# EAGLE design accel_sensor (EAGLE 9.3.0)
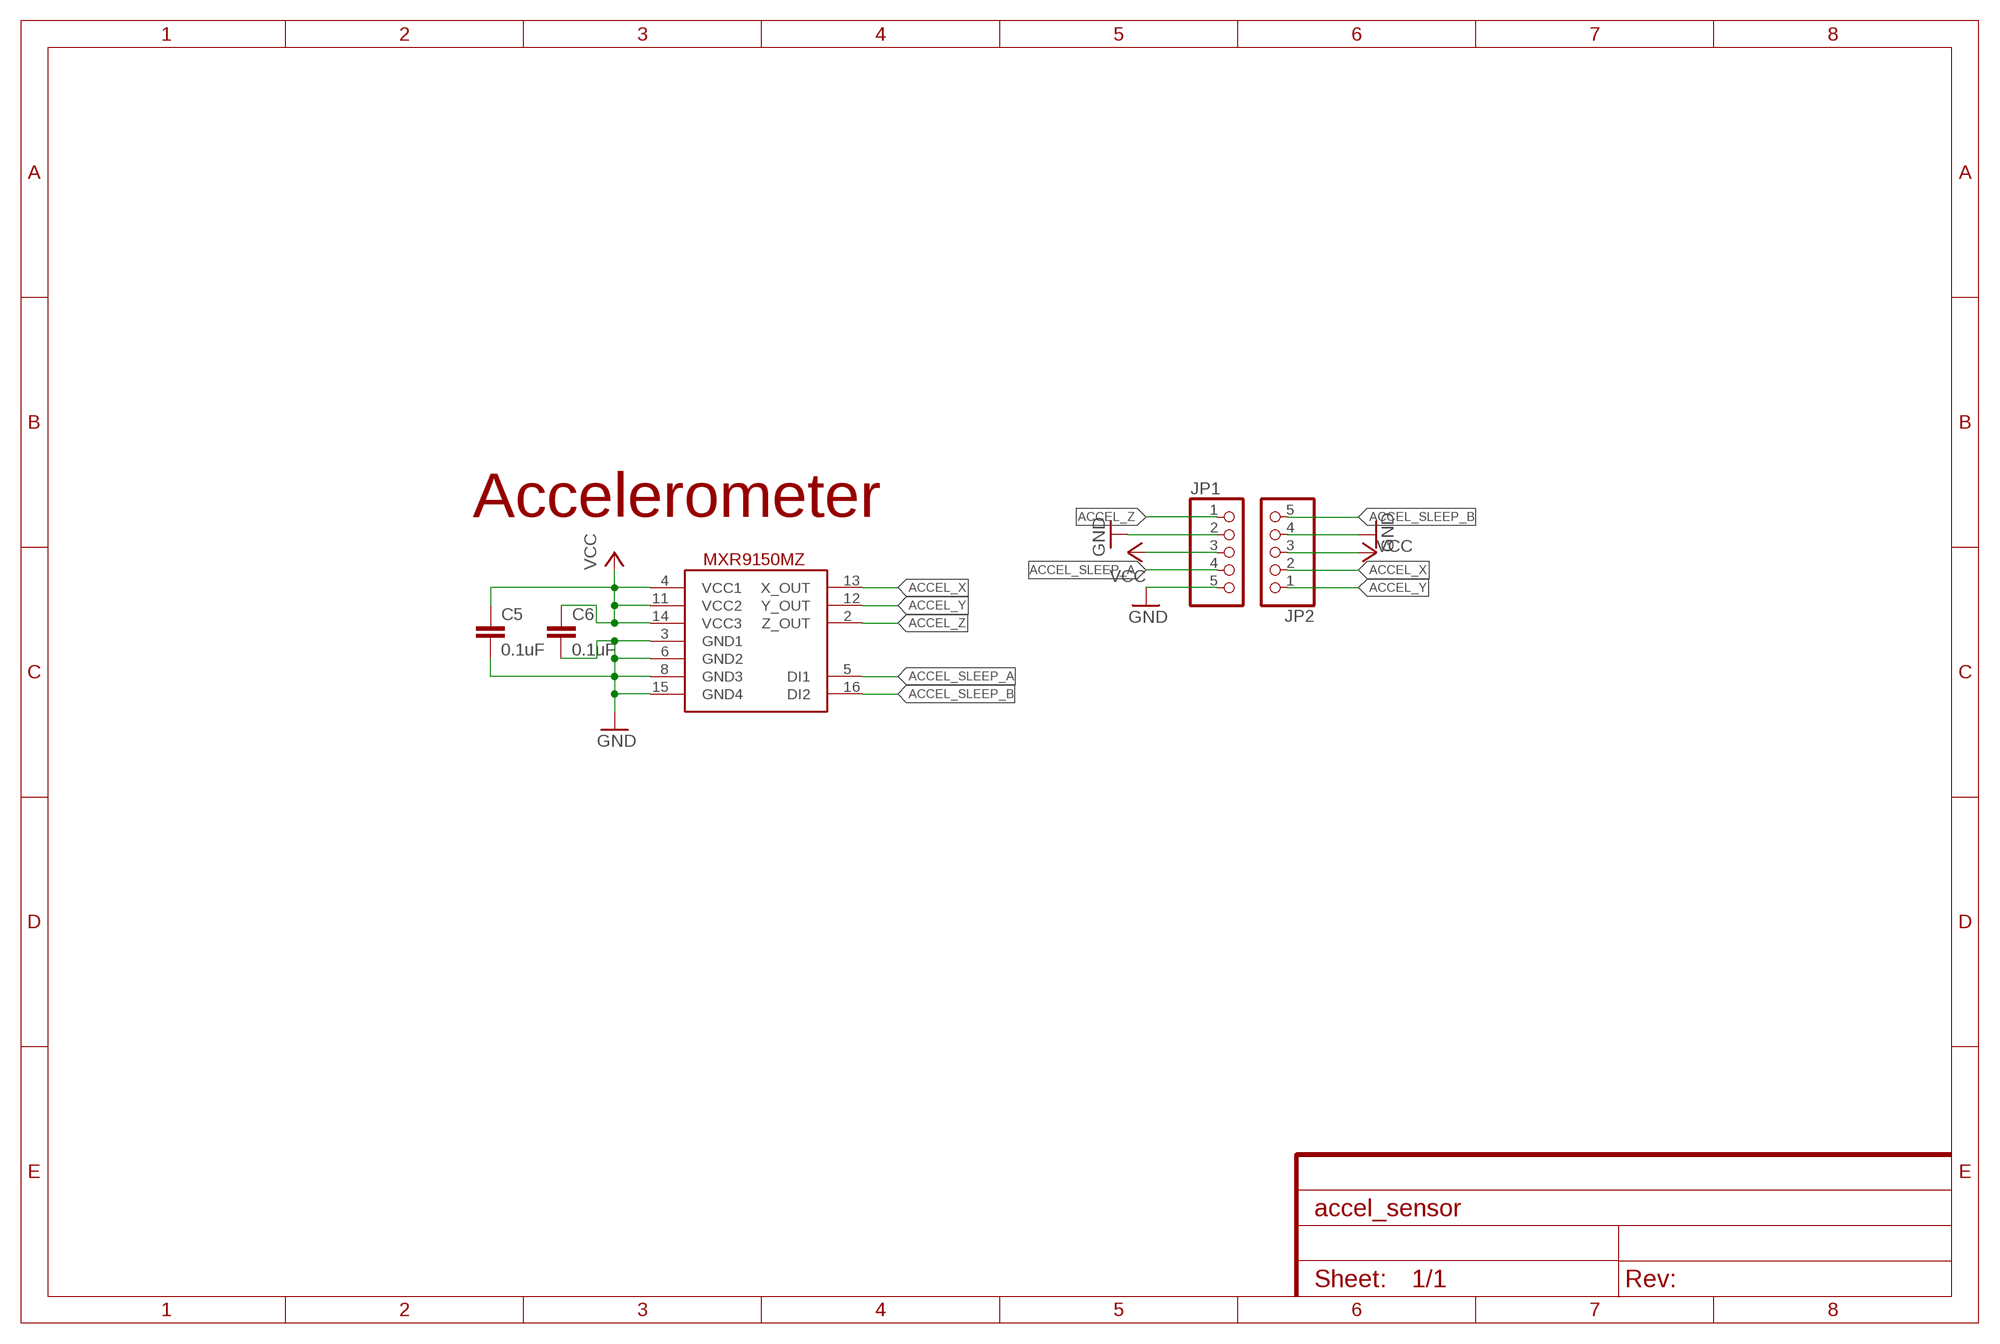
[diagram p0: schematic, sheet 1]

## Parts
C5  0.1uF  CAP0402-CAP  [0402-CAP]
C6  0.1uF  CAP0402-CAP  [0402-CAP]
JP1  PINHD-1X5  [1X05]
JP2  PINHD-1X5  [1X05]
U$1  ACCELEROMETER_MXR9150MZ  [MXR9150MZ]

## Nets
ACCEL_SLEEP_A: JP1.4 U$1.5(DI1)
ACCEL_SLEEP_B: JP2.5 U$1.16(DI2)
ACCEL_X: JP2.2 U$1.13(X_OUT)
ACCEL_Y: JP2.1 U$1.12(Y_OUT)
ACCEL_Z: JP1.1 U$1.2(Z_OUT)
GND: C5.2 C6.2 JP1.2 JP1.5 JP2.4 U$1.3(GND1) U$1.6(GND2) U$1.8(GND3) U$1.15(GND4)
VCC: C5.1 C6.1 JP1.3 JP2.3 U$1.4(VCC1) U$1.11(VCC2) U$1.14(VCC3)

## Notes on the sheet
- Accelerometer

## Library data of the parts
C5 C6 = SparkFun:CAP: Capacitor Standard 0603 ceramic capacitor, and 0.1" leaded capacitor.
JP1 JP2 = pinhead:PINHD-1X5: PIN HEADER
U$1 = Andy_Sigler_2019:ACCELEROMETER_MXR9150MZ

## Board
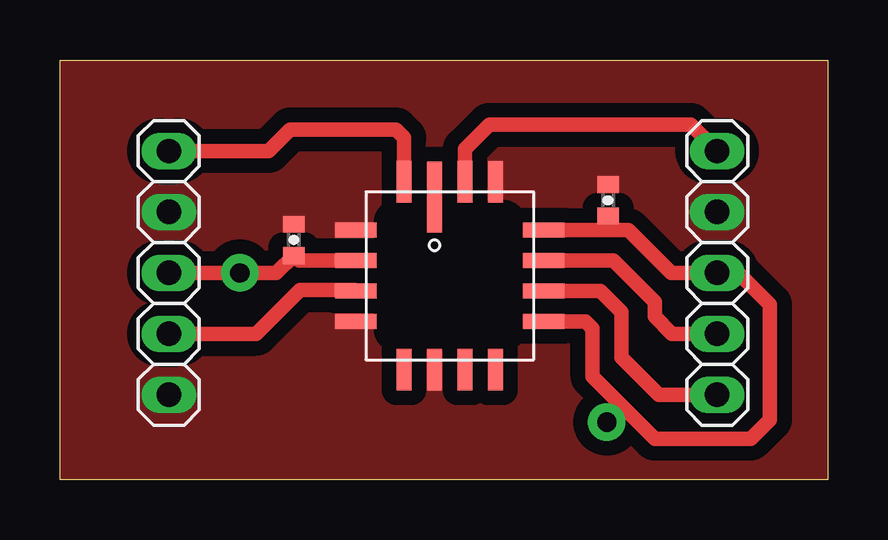
[diagram p1: board, top side]
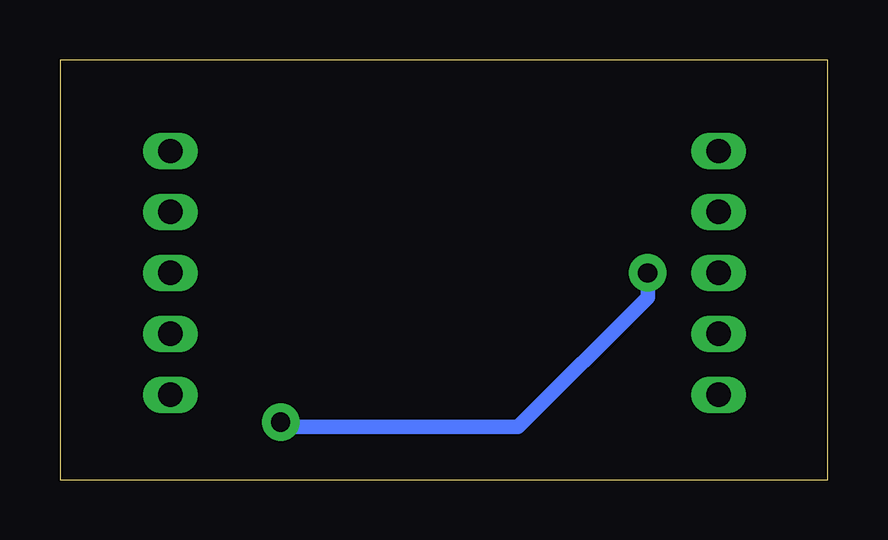
[diagram p2: board, bottom side, seen from below]

Size 32 x 17.5 mm. Coordinates in mm from the lower left corner, seen from the top.
Outline: 0,0 0,17.5 32,17.5 32,0 0,0
Copper layers (1*16): Top 0.035mm / dielectric 1.5mm / Bottom 0.035mm
Design rules "OthermillDRC_1_64_v2 *": minimum track width 16mil, minimum drill 31mil, track to track 0.39878125mm, track to pad 0.39878125mm, pad to pad 0.39878125mm, via to via 0.39878125mm, smd to smd 0mil, copper to edge 0mil, drill to drill 1mil, minimum pad ring 0mil, minimum via ring 15mil, stop-mask expansion 1mil, vias tented up to drill 30mil, thermal gap 10mil
tRestrict: area 14,6.2 to 18.5,10.8

### Footprints (pad centres in the part's own frame; a part is rotated, then mirrored left to right if it is on the bottom)
0402-CAP = smd 0.7 x 0.9: 1 -0.65,0; 2 0.65,0
1X05 = drill 1.016 long: 1 -5.08,0; 2 -2.54,0; 3 0,0; 4 2.54,0; 5 5.08,0
MXR9150MZ = smd 2.963 x 0.64: 1 3.281,0.635 | smd 1.722 x 0.64: 2 3.916,1.905; 7 -3.916,1.905; 8 -3.916,0.635; 9 -3.916,-0.635; 10 -3.916,-1.905; 15 3.916,-1.905; 16 3.916,-0.635 | smd 0.64 x 1.722: 3 1.905,3.916; 4 0.635,3.916; 5 -0.635,3.916; 6 -1.905,3.916; 11 -1.905,-3.916; 12 -0.635,-3.916; 13 0.635,-3.916; 14 1.905,-3.916

### Placement (x,y rotation side)
C5  9.75,10 90 top
C6  22.85,11.65 90 top
JP1  4.54,8.62 270 top
JP2  27.4,8.62 90 top
U$1  16.25,8.5 90 top

### Tracks (layer width: path | path; a pad name or v marks a point on that pad's centre or on a via)
ACCEL_SLEEP_A
  Top 0.61: JP1.4 8.18,6.08 10,7.9 12.3,7.9 U$1.5
ACCEL_SLEEP_B
  Top 0.61: U$1.16 16.89,13.79 17.9,14.8 26.3,14.8 JP2.5
ACCEL_X
  Top 0.61: JP2.2 25.52,6.08 24.8,6.8 24.8,7.4 23.07,9.13 U$1.13
ACCEL_Y
  Top 0.61: U$1.12 22.54,7.87 23.4,7 23.4,5.1 24.96,3.54 JP2.1
ACCEL_Z
  Top 0.61: U$1.2 14.35,14.26 14,14.6 9.6,14.6 8.7,13.7 JP1.1
GND
  pour Top (isolate 0.61, no thermals): 0,17.5 0,0 32,0 32,17.5
VCC  (via drill 0.8)
  Top 0.61: JP1.3 v7.5,8.62 9.02,8.62 C5.1 9.96,9.13 U$1.4 | U$1.14 22.7,10.4 | 22.7,10.4 23.7,10.4 25.48,8.62 JP2.3 28.28,8.62 29.6,7.3 29.6,2.5 28.8,1.7 24.8,1.7 23.45,3.05 | C6.1 22.7,10.85 22.7,10.4 | 23.45,3.05 22.2,4.3 22.2,6.3 21.9,6.6 21.89,6.59 U$1.11 | v22.8,2.4 23.45,3.05
  Bottom 0.61: v7.5,8.62 7.5,7.6 12.9,2.2 22.6,2.2 v22.8,2.4